# EAGLE design M0_Express_eh_shield_reve (EAGLE 9.5.2)

## Sheet 1 of 2
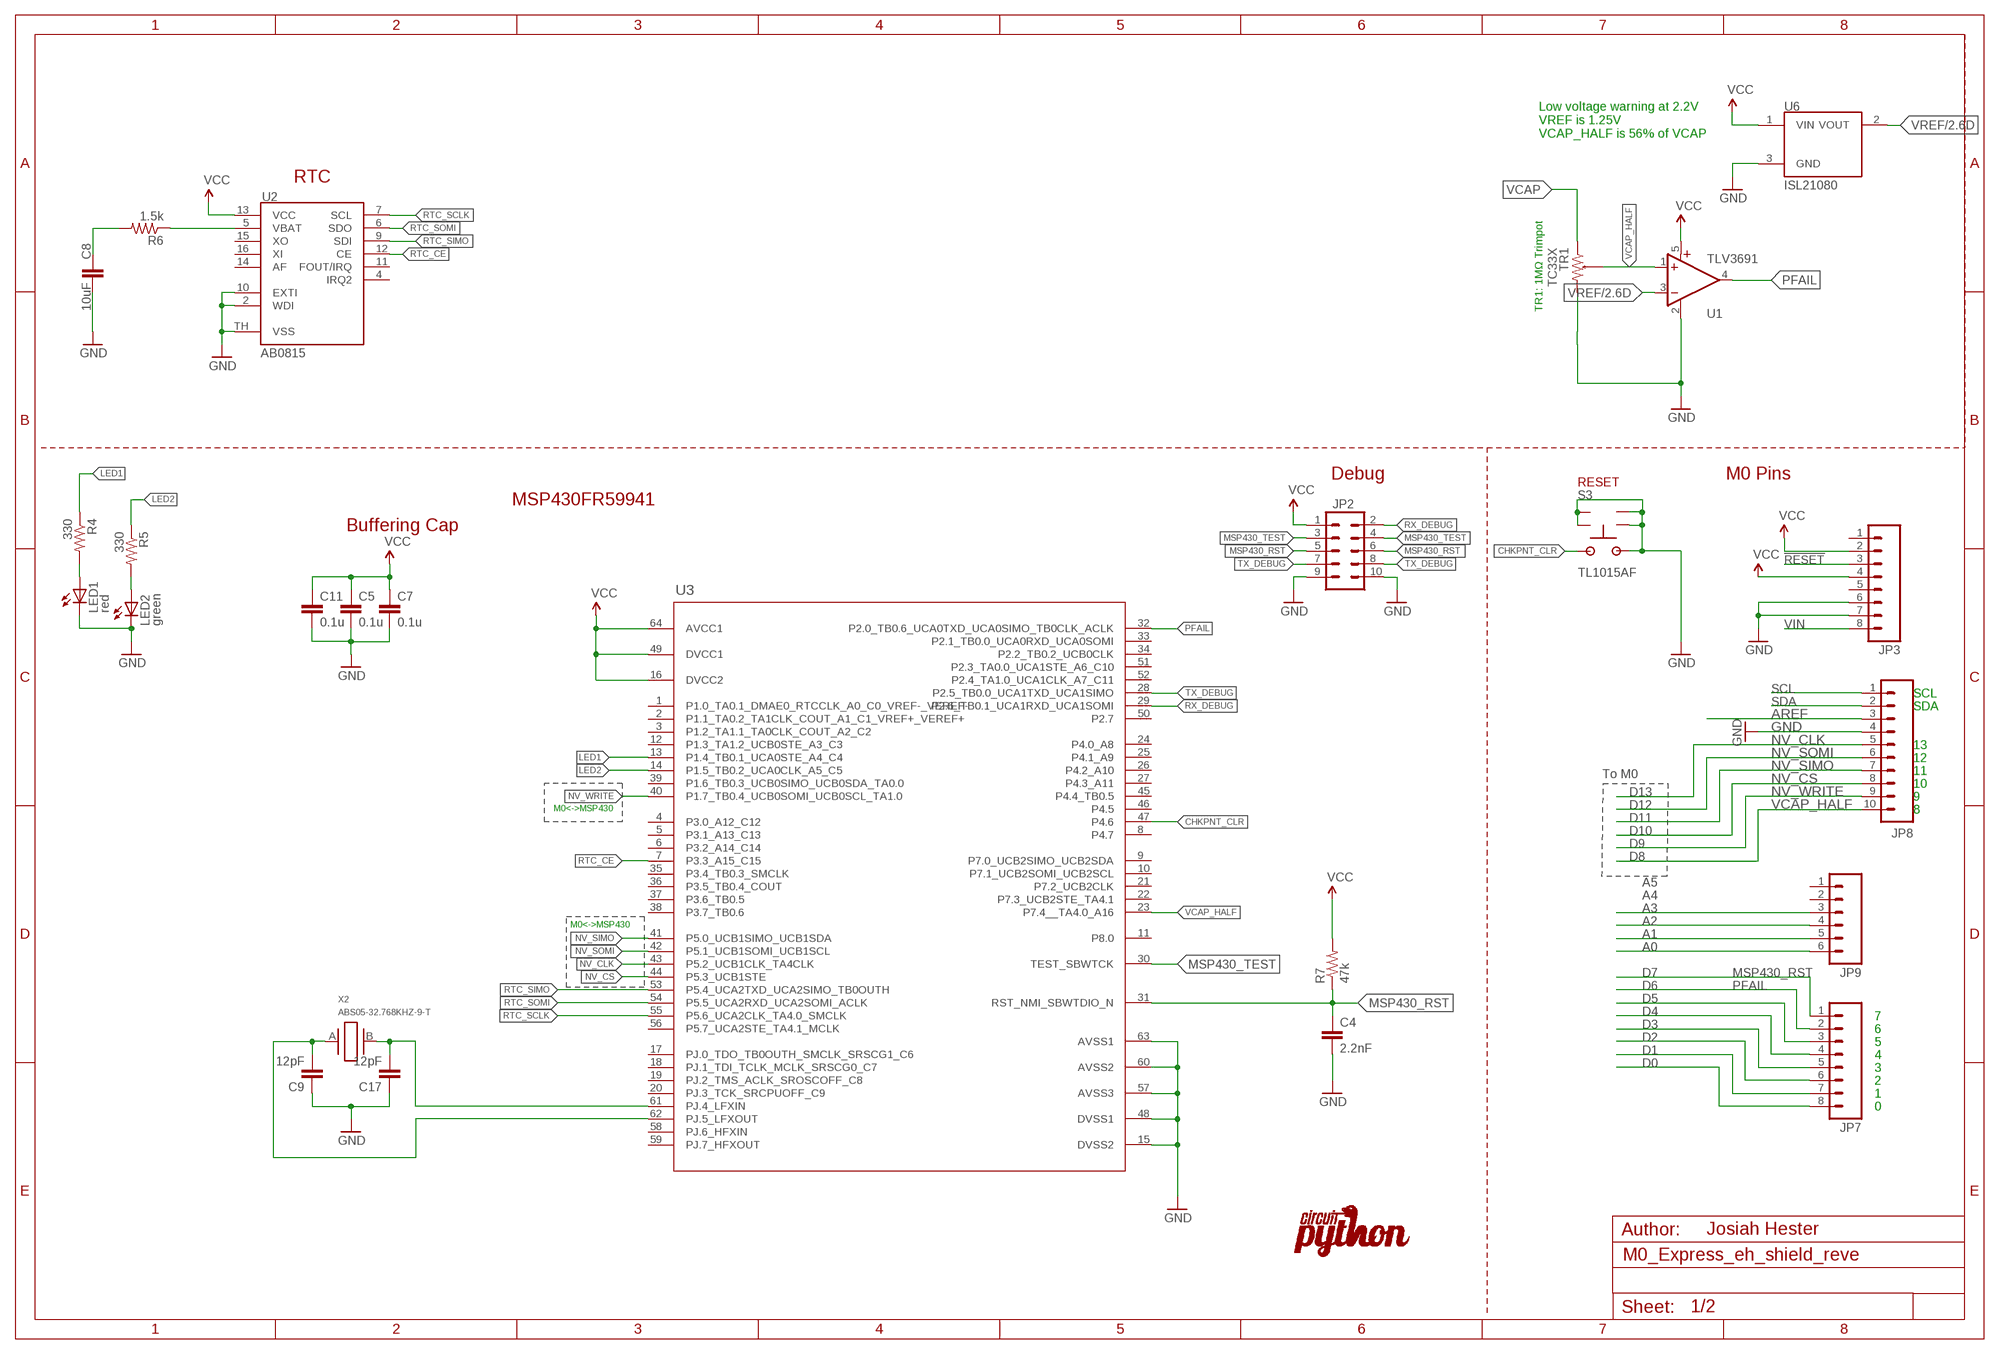
[diagram p0: schematic, sheet 1]

### Parts
C4  2.2nF  C-EU0603  [0603@1]
C5  0.1u  C-EU0603  [0603@1]
C7  0.1u  C-EU0603  [0603@1]
C8  10uF  CAP0805  [0805]
C9  12pF  C-EU0603  [0603@1]
C11  0.1u  C-EU0603  [0603@1]
C17  12pF  C-EU0603  [0603@1]
JP2  M05X21.27MM  [2X5_1.27MM]
JP3  M08LOCK  [1X08_LOCK]
JP7  M08LOCK  [1X08_LOCK]
JP8  M10LOCK  [1X10_LOCK]
JP9  M06LOCK  [1X06_LOCK]
LED1  red  LED0603  [LED-0603]
LED2  green  LED0603  [LED-0603]
R4  330  R-EU0603  [0603]
R5  330  R-EU0603  [0603]
R6  1.5k  R-EU0603  [0603]
R7  47k  R-EU0603  [0603]
S3  TL1015AF  [TS1015]
TR1  TC33X  [TC33X]
U1  TLV3691  [SC70-5]
U2  AB0815  [QFN16]
U3  MSP430FR5994IPM  [PM0064A_N]
U6  ISL21080  [SOT-23]
U$1  LOGO  [CIRCUITPYTHON-LOGO]
X2  ABS05-32.768KHZ-9-T  [ABS05]

### Nets
!RESET: JP3.3
A0: JP9.6
A1: JP9.5
A2: JP9.4
A3: JP9.3
AREF [aref]: JP8.3
CHKPNT_CLR: S3.2 U3.47(P4.6)
D0: JP7.8
D1: JP7.7
D2: JP7.6
D3: JP7.5
D4: JP7.4
D5: JP7.3
GND [gnd]: C4.2 C5.2 C7.2 C8.2 C9.1 C11.2 C17.1 JP2.9 JP2.10 JP3.6 JP3.7 JP8.4 LED1.C LED2.C S3.1 S3.G1(GND) S3.G2(GND) S3.G3(GND) S3.G4(GND) TR1.2 U1.2(GND) U2.2(WDI) U2.10(EXTI) U2.TH(VSS) U3.15(DVSS2) U3.48(DVSS1) U3.57(AVSS3) U3.60(AVSS2) U3.63(AVSS1) U6.3(GND) ; also sheet 2
LED1: R4.1 U3.13(P1.4_TB0.1_UCA0STE_A4_C4)
LED2: R5.1 U3.14(P1.5_TB0.2_UCA0CLK_A5_C5)
MSP430_RST: C4.1 JP2.5 JP2.6 JP7.1 R7.1 U3.31(RST_NMI_SBWTDIO_N)
MSP430_TEST: JP2.3 JP2.4 U3.30(TEST_SBWTCK)
N$3: JP3.2 ; supply symbol labelled VCC
N$4: R6.1 U2.5(VBAT)
N$5: C17.2 U3.61(PJ.4_LFXIN) X2.B
N$6: C9.2 U3.62(PJ.5_LFXOUT) X2.A
N$8: C8.1 R6.2
N$14: LED1.A R4.2
N$15: LED2.A R5.2
NV_CLK: JP8.5 U3.43(P5.2_UCB1CLK_TA4CLK)
NV_CS: JP8.8 U3.44(P5.3_UCB1STE)
NV_SIMO: JP8.7 U3.41(P5.0_UCB1SIMO_UCB1SDA)
NV_SOMI: JP8.6 U3.42(P5.1_UCB1SOMI_UCB1SCL)
NV_WRITE: JP8.9 U3.40(P1.7_TB0.4_UCB0SOMI_UCB0SCL_TA1.0)
PFAIL: JP7.2 U1.4(OUT) U3.32(P2.0_TB0.6_UCA0TXD_UCA0SIMO_TB0CLK_ACLK)
RTC_CE: U2.12(CE) U3.7(P3.3_A15_C15)
RTC_SCLK: U2.7(SCL) U3.55(P5.6_UCA2CLK_TA4.0_SMCLK)
RTC_SIMO: U2.9(SDI) U3.53(P5.4_UCA2TXD_UCA2SIMO_TB0OUTH)
RTC_SOMI: U2.6(SDO) U3.54(P5.5_UCA2RXD_UCA2SOMI_ACLK)
RX_DEBUG: JP2.2 U3.29(P2.6_TB0.1_UCA1RXD_UCA1SOMI)
SCL: JP8.1
SDA: JP8.2
TX_DEBUG: JP2.7 JP2.8 U3.28(P2.5_TB0.0_UCA1TXD_UCA1SIMO)
VCAP: TR1.1 ; also sheet 2
VCAP_HALF: JP8.10 TR1.W U1.1(+IN) U3.23(P7.4__TA4.0_A16)
VCC: C5.1 C7.1 C11.1 JP2.1 JP3.4 R7.2 U1.5(V+) U2.13(VCC) U3.16(DVCC2) U3.49(DVCC1) U3.64(AVCC1) U6.1(VIN) ; also sheet 2
VIN [USB]: JP3.8
VREF: U1.3(-IN) U6.2(VOUT) ; also sheet 2
Unconnected: JP3.1 JP3.5 JP9.1 JP9.2 U2.4(IRQ2) U2.11(FOUT/IRQ) U2.14(AF) U2.15(XO) U2.16(XI) U3.1(P1.0_TA0.1_DMAE0_RTCCLK_A0_C0_VREF-_VEREF-) U3.2(P1.1_TA0.2_TA1CLK_COUT_A1_C1_VREF+_VEREF+) U3.3(P1.2_TA1.1_TA0CLK_COUT_A2_C2) U3.4(P3.0_A12_C12) U3.5(P3.1_A13_C13) U3.6(P3.2_A14_C14) U3.8(P4.7) U3.9(P7.0_UCB2SIMO_UCB2SDA) U3.10(P7.1_UCB2SOMI_UCB2SCL) U3.11(P8.0) U3.12(P1.3_TA1.2_UCB0STE_A3_C3) U3.17(PJ.0_TDO_TB0OUTH_SMCLK_SRSCG1_C6) U3.18(PJ.1_TDI_TCLK_MCLK_SRSCG0_C7) U3.19(PJ.2_TMS_ACLK_SROSCOFF_C8) U3.20(PJ.3_TCK_SRCPUOFF_C9) U3.21(P7.2_UCB2CLK) U3.22(P7.3_UCB2STE_TA4.1) U3.24(P4.0_A8) U3.25(P4.1_A9) U3.26(P4.2_A10) U3.27(P4.3_A11) U3.33(P2.1_TB0.0_UCA0RXD_UCA0SOMI) U3.34(P2.2_TB0.2_UCB0CLK) U3.35(P3.4_TB0.3_SMCLK) U3.36(P3.5_TB0.4_COUT) U3.37(P3.6_TB0.5) U3.38(P3.7_TB0.6) U3.39(P1.6_TB0.3_UCB0SIMO_UCB0SDA_TA0.0) U3.45(P4.4_TB0.5) U3.46(P4.5) U3.50(P2.7) U3.51(P2.3_TA0.0_UCA1STE_A6_C10) U3.52(P2.4_TA1.0_UCA1CLK_A7_C11) U3.56(P5.7_UCA2STE_TA4.1_MCLK) U3.58(PJ.6_HFXIN) U3.59(PJ.7_HFXOUT)

### Notes on the sheet
- Low voltage warning at 2.2V
  VREF is 1.25V
  VCAP_HALF is 56% of VCAP
- RTC
- TR1: 1MΩ Trimpot
- Debug | M0 Pins
- RESET
- MSP430FR59941
- Buffering Cap
- SCL
- SDA
- 13
- 12
- 11
- To M0
- 10
- D13 | 9
- M0<->MSP430 | D12 | 8
- D11
- D10
- D9
- D8
- A5
- A4
- M0<->MSP430
- D7
- D6
- 7
- 6
- 5
- 4
- 3
- 2
- 1
- 0
- Josiah Hester

## Sheet 2 of 2
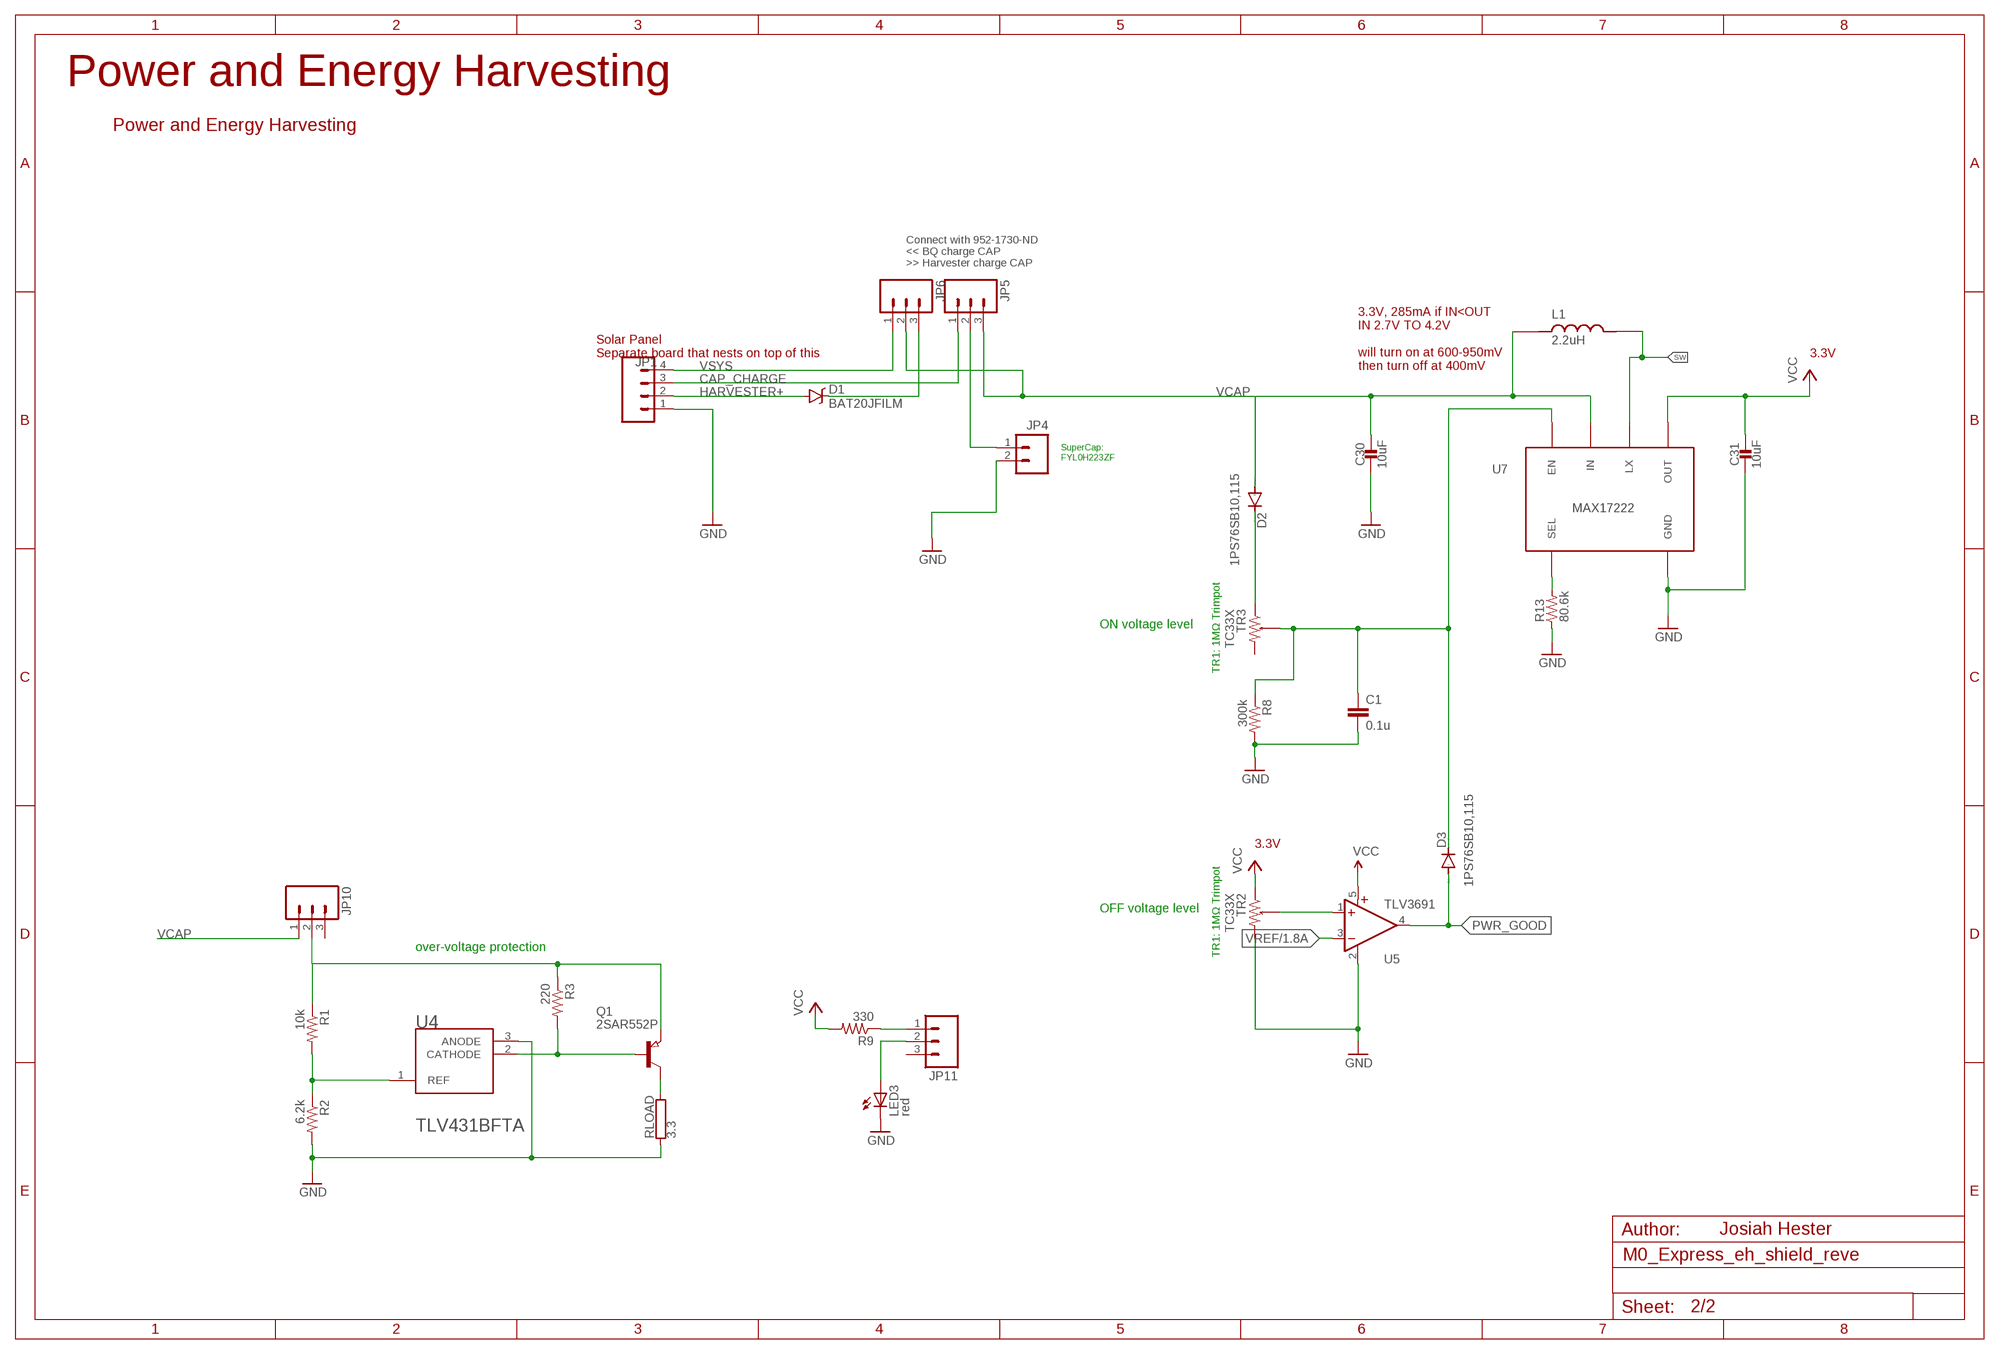
[diagram p1: schematic, sheet 2]

### Parts
C1  0.1u  C-EU0603  [0603@1]
C30  10uF  CAPACITOR0603_CAP  [0603_CAP]
C31  10uF  CAPACITOR0603_CAP  [0603_CAP]
D1  BAT20JFILM  [SOD-323]
D2  1PS76SB10,115  DIODE-SOD323-R  [SOD323-R]
D3  1PS76SB10,115  DIODE-SOD323-R  [SOD323-R]
JP1  M04LOCK  [1X04_LOCK]
JP4  M025MM  [SCREWTERMINAL-5MM-2]
JP5  M03  [1X03-1.27MM]
JP6  M03  [1X03-1.27MM]
JP10  M03  [1X03-1.27MM]
JP11  M03  [1X03-1.27MM]
L1  2.2uH  XFL4020-222MEB  [IND_XFL4020-222MEB]
LED3  red  LED0603  [LED-0603]
Q1  2SAR552P  PNP-TRANSISTOR_SOT89  [SOT89]
R1  10k  R-EU0603  [0603]
R2  6.2k  R-EU0603  [0603]
R3  220  R-EU0603  [0603]
R8  300k  R-EU0603  [0603]
R9  330  R-EU0603  [0603]
R13  80.6k  RESISTOR0603_RES  [0603-RES]
RLOAD  3.3  RCA4060  [CA4060]
TR2  TC33X  [TC33X]
TR3  TC33X  [TC33X]
U4  DIODES_TLV431BFTADIODES_TLV431BFTA_0_0  [DIODES_TLV431BFTA_0]
U5  TLV3691  [SC70-5]
U7  MAX17222  [UDFN-6-MAXIM]

### Nets
CAP_CHARGE: JP1.3 JP5.1
GND [gnd]: C1.2 C30.2 C31.2 JP1.1 JP4.2 LED3.C R2.2 R8.2 R13.1 RLOAD.1 TR2.2 U4.3(ANODE) U5.2(GND) U7.3(GND) ; also sheet 1
HARVESTER+: D1.A JP1.2
N$1: D1.C JP6.3
N$2: JP4.1 JP5.2
N$7: R1.2 R2.1 U4.1(REF)
N$9: JP11.1 R9.1
N$10: JP10.2 Q1.3(E) R1.1 R3.1
N$11: Q1.1(B) R3.2 U4.2(CATHODE)
N$12: R13.2 U7.4(SEL)
N$13: Q1.2(C) RLOAD.2
N$16: C1.1 D3.C R8.1 TR3.W U7.6(EN)
N$17: D2.C TR3.1
N$18: JP11.2 LED3.A
ON_LVL: TR2.W U5.1(+IN)
PWR_GOOD: D3.A U5.4(OUT)
SW: L1.2 U7.2(LX)
VCAP: C30.1 D2.A JP5.3 JP6.2 JP10.1 L1.1 U7.5(IN) ; also sheet 1
VCC: C31.1 R9.2 TR2.1 U5.5(V+) U7.1(OUT) ; also sheet 1
VREF: U5.3(-IN) ; also sheet 1
VSYS: JP1.4 JP6.1
Unconnected: JP10.3 JP11.3 TR3.2

### Notes on the sheet
- Power and Energy Harvesting
- Power and Energy Harvesting
- Connect with 952-1730-ND
  << BQ charge CAP
  >> Harvester charge CAP
- Solar Panel
  Separate board that nests on top of this
- 3.3V
- 3.3V, 285mA if IN<OUT
  IN 2.7V TO 4.2V
  
  will turn on at 600-950mV
  then turn off at 400mV
- SuperCap:
  FYL0H223ZF
- TR1: 1MΩ Trimpot
- ON voltage level
- 3.3V
- TR1: 1MΩ Trimpot
- OFF voltage level
- over-voltage protection
- Divider for Lithium Titanate
- Josiah Hester

## Library data of the parts
C1 C5 C7 C11 = tiny_passives:C-EU; DIGIKEY: 1276-1005-1-ND; MPN: CL10B104KO8NNNC
C4 = tiny_passives:C-EU; DIGIKEY: 478-1219-1-ND; MPN: 06035C222KAT2A
C8 = SparkFun-Capacitors:CAP: Capacitor Standard 0603 ceramic capacitor, and 0.1" leaded capacitor.; DIGIKEY: 1276-6456-1-ND
C9 C17 = tiny_passives:C-EU; DIGIKEY: 1276-1254-1-ND; MPN: CL10C120JB8NNNC
C30 C31 = passives:CAPACITOR: SMD Capacitor; DIGIKEY: 490-3896-1-ND; MPN: GRM188R60J106ME47D
D1 = SparkFun-DiscreteSemi:BAT20JFILM: 23V, 1A Schottky diode, SOD-323 package; DIGIKEY: NSR0530HT1GOSCT-ND; PROD_ID: DIO-11623
D2 D3 = diode:DIODE-: DIODE
JP1 = SparkFun-Connectors:M04: Header 4 Standard 4-pin 0.1" header. Use with straight break away headers (SKU : PRT-00116), right angle break away headers (PRT-00553), swiss pins (PRT-00743), machine pins (PRT-00117), and female headers (PRT-00115). Molex polarized connector foot print use with SKU : PRT-08231 with associated crimp pins and housings. 1MM SMD Version SKU: PRT-10208
JP2 = SparkFun-Connectors:M05X2: Header 5x2 Standard 10-pin dual row 0.1" header. Commonly used with AVR-ISP. Use with Spark Fun Electronics SKU: PRT-00778; DIGIKEY: 1175-1627-ND; MPN: 3220-10-0100-00
JP3 JP7 = SparkFun-Connectors:M08: Header 8 Standard 8-pin 0.1" header. Use with straight break away headers (SKU : PRT-00116), right angle break away headers (PRT-00553), swiss pins (PRT-00743), machine pins (PRT-00117), and female headers (PRT-00115).
JP4 = SparkFun-Connectors:M02: Standard 2-pin 0.1" header. Use with - straight break away headers ( PRT-00116) - right angle break away headers (PRT-00553) - swiss pins (PRT-00743) - machine pins (PRT-00117) - female headers (PRT-00115) Molex polarized connector foot print use with: PRT-08233 with associated crimp pins and housings. 2.54_SCREWTERM for use with PRT-10571. 3.5mm Screw Terminal footprints for PRT-08084 5mm Screw Terminal footprints for use with PRT-08432; STOREFRONT_ID: PRT-08432
JP5 JP6 JP10 JP11 = SparkFun-Connectors:M03: Header 3 Standard 3-pin 0.1" header. Use with straight break away headers (SKU : PRT-00116), right angle break away headers (PRT-00553), swiss pins (PRT-00743), machine pins (PRT-00117), and female headers (PRT-00115). Molex polarized connector foot print use with SKU : PRT-08232 with associated crimp pins and housings.
JP8 = SparkFun-Connectors:M10: Header 10 Standard 10-pin 0.1" header. Use with straight break away headers (SKU : PRT-00116), right angle break away headers (PRT-00553), swiss pins (PRT-00743), machine pins (PRT-00117), and female headers (PRT-00115).
JP9 = SparkFun-Connectors:M06: Header 6 Standard 6-pin 0.1" header. Use with straight break away headers (SKU : PRT-00116), right angle break away headers (PRT-00553), swiss pins (PRT-00743), machine pins (PRT-00117), and female headers (PRT-00115). Molex polarized connector foot print use with SKU : PRT-08094 with associated crimp pins and housings. NOTES ON THE VARIANTS LOCK and LOCK_LONGPADS... This footprint was designed to help hold the alignment of a through-hole component (i.e. 6-pin header) while soldering it into place. You may notice that each hole has been shifted either up or down by 0.005 of an inch from it's more standard position (which is a perfectly straight line). This slight alteration caused the pins (the squares in the middle) to touch the edges of the holes. Because they are alternating, it causes a "brace" to hold the component in place. 0.005 has proven to be the perfect amount of "off-center" position when using our standard breakaway headers. Although looks a little odd when you look at the bare footprint, once you have a header in there, the alteration is very hard to notice. Also,if you push a header all the way into place, it is covered up entirely on the bottom side. This idea of altering the position of holes to aid alignment will be further integrated into the Sparkfun Library for other footprints. It can help hold any component with 3 or more connection pins.
L1 = XFL4020-222MEB:XFL4020-222MEB: Power inductor, shielded, 20% tol, SMT, RoHS, halogen free Check availability <https://pricing.snapeda.com/parts/XFL4020-222MEB/Coilcraft/view-part?ref=eda>; AVAILABILITY: In Stock; DESCRIPTION: Power inductor, shielded, 20% tol, SMT, RoHS, halogen free; MF: Coilcraft; MP: XFL4020-222MEB; PACKAGE: None; PRICE: None
LED1-LED3 = SparkFun-LED:LED: LEDs Standard schematic elements and footprints for 5mm, 3mm, 1206, and 0603 sized LEDs. 5mm - Spark Fun Electronics SKU : COM-00529 (and others)
Q1 = semicon-smd-ipc:PNP-TRANSISTOR_: PNP TRANSISTOR
R1-R5 R8 R9 = tiny_passives:R-EU
R6 = tiny_passives:R-EU; DIGIKEY: A121524CT-ND; MPN: CRG0603F1K5
R7 = tiny_passives:R-EU; DIGIKEY: 541-4061-1-ND; MPN: CRCW060347K0JNEAC
R13 = passives:RESISTOR: Resistor Basic schematic elements and footprints for 0201, 0402, 0603, 1206, and PTH resistors.; DIGIKEY: 311-80.6KHRCT-ND; MPN: RC0603FR-0780K6L
RLOAD = resistor-power:R: Power Resitor; OC_FARNELL: unknown; OC_NEWARK: unknown
S3 = eswitch:TL1015AF; MPN: TL1015AF160QG
TR1-TR3 = bourns_tc33_trimpots:TC33X; DIGIKEY: TC33X-2-105ECT-ND; MPN: TC33X-2-105E
U1 U5 = tlv3691:TLV3691: 0.9-V to 6.5-V, Nanopower Comparator Datasheets Analog Signal Chain Guide <http://www.ti.com/lit/pdf/slyb174> TLV3691 <http://www.ti.com/lit/ds/symlink/tlv3691.pdf> Manufacturer Product Page TLV3691IDPFR Specifications <http://www.ti.com/general/docs/suppproductinfo.tsp?distId=10&orderablePartNumber=TLV3691IDPFR> Standard Package <javascript:dlgHelp('Standard%20Packaging%20Help');> 1 Category Integrated Circuits (ICs) </product-search/en/integrated-circuits-ics> Family Linear - Comparators </product-search/en/integrated-circuits-ics/linear-comparators/2556221> Series - Packaging <javascript:dlgHelp('Standard%20Packaging%20Help');> Cut Tape (CT) <javascript:dlgHelp('Cut%20Tape%20Help');> Type General Purpose Number of Elements 1 Output Type Push-Pull Voltage - Supply, Single/Dual (±) 0.9 V ~ 6.5 V, ±0.45 V ~ 3.25 V Voltage - Input Offset (Max) 3mV Current - Input Bias (Max) 100pA Current - Output (Typ) 42mA Current - Quiescent (Max) 150nA CMRR, PSRR (Typ) - Propagation Delay (Max) 35µs Hysteresis - Operating Temperature -40°C ~ 125°C Package / Case 6-XFDFN Mounting Type Surface Mount Supplier Device Package 6-X2SON (1x1) Online Catalog Comparators - 1 element </catalog/en/partgroup/comparators-1-element/3112?mpart=TLV3691IDPFR&vendor=296&WT.z_ref_page_type=PS&WT.z_ref_page_sub_type=PD&WT.z_ref_page_id=PD&WT.z_ref_page_event=DC_Link_Table> Other Names 296-37242-1; DIGIKEY: 296-37910-1-ND; MPN: TLV3691IDCKR
U2 = AB08XX:AB0815: AB08X5 Real-Time Clock Family: SPI The ABRACON AB08X5 Real-Time Clock family provides a groundbreaking combination of ultra-low power coupled with a highly sophisticated feature set. With power requirements significantly lower than any other industry RTC (as low as 14 nA), these are the first semiconductors based on innovative SPOTTM (Subthreshold Power Optimized Technology) CMOS platform. The AB08X5 includes on-chip oscillators to provide minimum power consumption, full RTC functions including battery backup and programmable counters and alarms for timer and watchdog functions, and either an I2C or SPI serial interface for communication with a host controller.; DIGIKEY: 535-11930-1-ND; MPN: AB0815-T3
U3 = msp430FR5994IMP:MSP430FR5994IPM; COPYRIGHT: Copyright (C) 2022 Ultra Librarian. All rights reserved.; DIGIKEY: 296-45561-1-ND; MANUFACTURER_PART_NUMBER: MSP430FR5994IPM; MFR_NAME: Texas Instruments; REFDES: RefDes; TYPE: TYPE
U4 = Diodes - TLV431BFTA:DIODES_TLV431BFTA: 1.24V COST EFFECTIVE SHUNT REGULATOR; CENTROID_NOT_SPECIFIED: No; DATASHEET: https://www.diodes.com/assets/Datasheets/TLV431.pdf; DIGIKEY_DESCRIPTION: IC VREF SHUNT ADJ SOT23-3; DIGIKEY_PART_NUMBER: TLV431BFCT-ND; LEAD_FREE: yes; MF: Diodes; MOUSER_PART_NUMBER: 621-TLV431BFTA; MPN: TLV431BFTA; PACKAGE: SOT23-3; PREFIX: U; ROHS: yes; TEMPERATURE_RANGE_HIGH: +125°C; TEMPERATURE_RANGE_LOW: -40°C
U6 = isl21080:ISL21080: Intersil: ISL21080, 300nA NanoPower Voltage References The ISL21080 analog voltage references feature low supply voltage operation at ultra-low 310nA typ, 1.5µA max operating current. Additionally, the ISL21080 family features guaranteed initial accuracy as low as ±0.2% and 50ppm/°C temperature coefficient. These references are ideal for general purpose portable applications to extend battery life at lower cost. The ISL21080 is provided in the industry standard 3 Ld SOT-23 pinout. The ISL21080 output voltages can be used as precision voltage sources for voltage monitors, control loops, standby voltages for low power states for DSP, FPGA, Datapath Controllers, microcontrollers and other core voltages: 0.9V, 1.024V, 1.25V, 1.5V, 2.048V, 2.5V, 3.0V, 3.3V, 4.096V and 5.0V. Special Note: Post-assembly x-ray inspection may lead to permanent changes in device output voltage and should be minimized or avoided. For further information, please see “Applications Information” on page 14 and AN1533, “X-Ray Effects on Intersil FGA References”.; DIGIKEY: ISL21080DIH312Z-TKTR-ND; MPN: ISL21080DIH312Z-TK
U7 = chips:MAX17222: Very high efficiency, very low power boost converter suitable for EH applications; DIGIKEY: MAX17222ELT+TCT-ND; MANUFACTURER: MAXIM INTEGRATED; MPN: MAX17222ELT+T
U$1 = circuitpython-logo:LOGO
X2 = abs05:ABS05-32.768KHZ: 32.768kHz Crystal; DIGIKEY: 535-11897-1-ND; MPN: ABS05-32.768KHZ-9-T

## Board
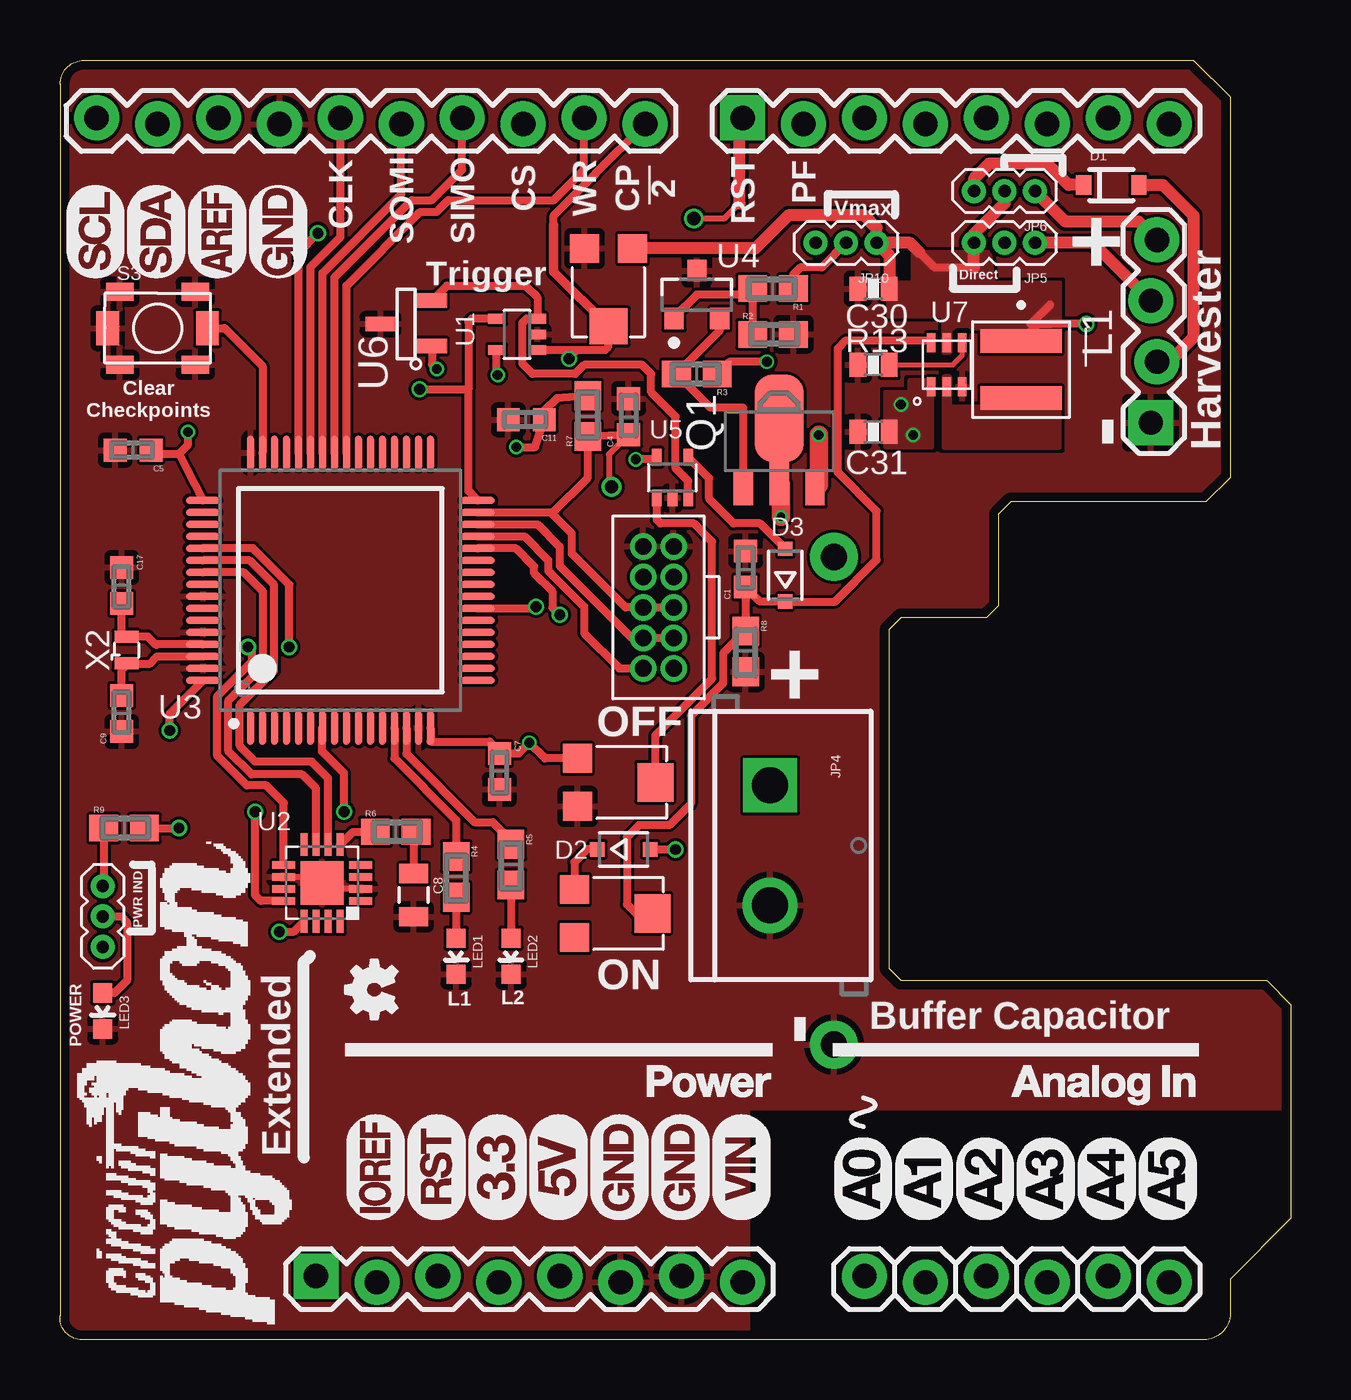
[diagram p2: board, top side]
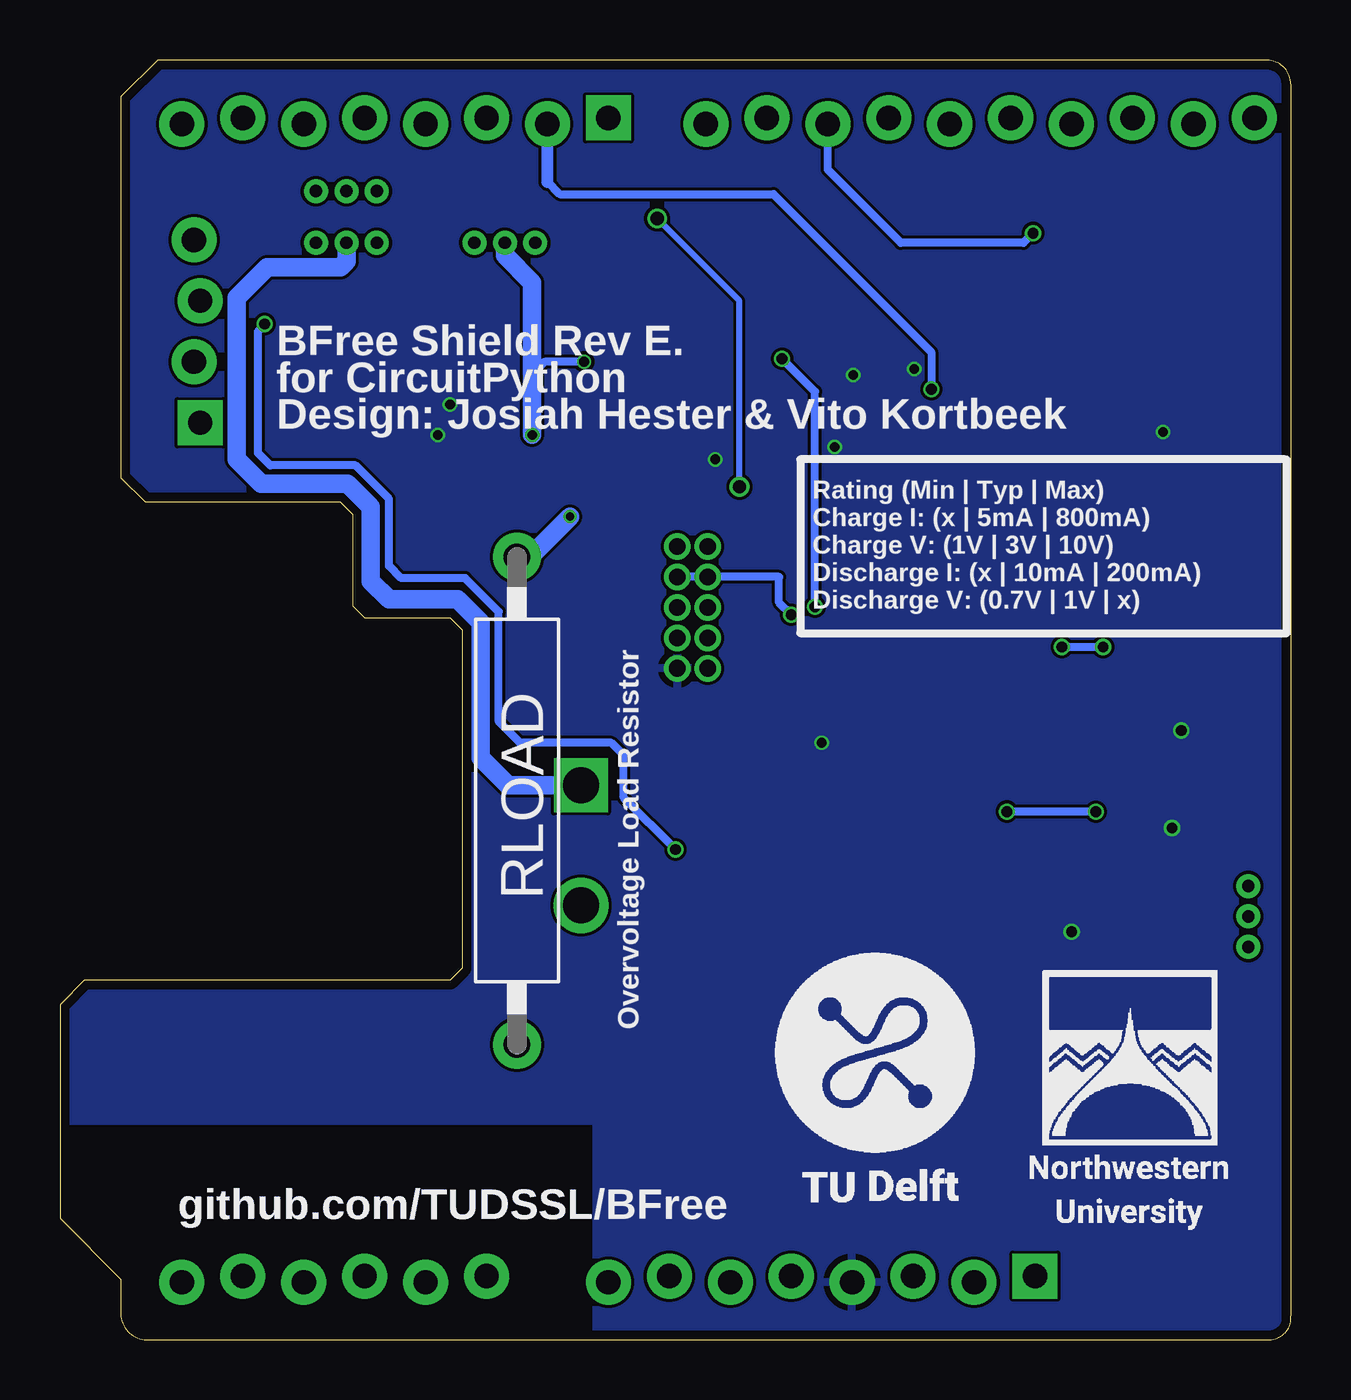
[diagram p3: board, bottom side, seen from below]

Size 51.31 x 53.32 mm. Coordinates in mm from the lower left corner, seen from the top.
Outline: 47.25,53.32 48.77,51.8 48.77,35.92 47.76,34.9 39.63,34.9 39.12,34.4 39.12,30.59 38.61,30.08 35.06,30.08 34.55,29.57 34.55,15.47 35.06,14.97 50.3,14.97 51.31,13.95 51.31,5.06 48.77,2.52 48.77,0.98 arc-90 47.59,0 0.83,0 arc-90 0,1 0,52.3 arc-90 1,53.3 47.25,53.32
Copper layers (1*16): Top 0.035559375mm / dielectric 0.17018125mm / Bottom 0.035559375mm
Design rules "oshpark-4layer *": minimum track width 5mil, minimum drill 10mil, track to track 5mil, track to pad 5mil, pad to pad 5mil, via to via 5mil, smd to smd 5mil, copper to edge 15mil, drill to drill 6mil, minimum pad ring 4mil, minimum via ring 4mil, stop-mask expansion 2.5mil, vias tented up to drill 0mil, thermal gap 10mil
tKeepout: area 76.4,1 to 76.5,1.5
tRestrict: area 74.9,2 to 75.4,2; area 74.9,1.5 to 75.4,1.5; area 75.4,1 to 75.5,1.5; area 83.1,1.2 to 83.2,1.8

### Footprints (pad centres in the part's own frame; a part is rotated, then mirrored left to right if it is on the bottom)
0603@1 = smd 0.95 x 0.95: 1 -0.75,0; 2 0.75,0
0805 = smd 0.8 x 1.2: 1 -0.9,0; 2 0.9,0
0603_CAP = smd 0.7 x 1: 1 -0.65,0; 2 0.65,0
SOD-323 = smd 0.63 x 0.83: A 1.15,0; C -1.15,0
SOD323-R = smd 0.6 x 0.6: A 1.1,0; C -1.1,0
1X04_LOCK = drill 1.016 pad 1.88 square: 1 0,0.127 | drill 1.016 pad 1.88: 2 2.54,-0.127; 3 5.08,0.127; 4 7.62,-0.127
2X5_1.27MM = drill 0.7 pad 1.1: 1 0,0; 2 1.27,0; 3 0,-1.27; 4 1.27,-1.27; 5 0,-2.54; 6 1.27,-2.54; 7 0,-3.81; 8 1.27,-3.81; 9 0,-5.08; 10 1.27,-5.08
1X08_LOCK = drill 1.016 pad 1.88 square: 1 0,0.127 | drill 1.016 pad 1.88: 2 2.54,-0.127; 3 5.08,0.127; 4 7.62,-0.127; 5 10.16,0.127; 6 12.7,-0.127; 7 15.24,0.127; 8 17.78,-0.127
SCREWTERMINAL-5MM-2 = drill 1.5 pad 2.232 square: 1 0,0 | drill 1.5 pad 2.3: 2 5,0
1X03-1.27MM = drill 0.508 pad 1: 1 -1.27,0; 2 0,0; 3 1.27,0
1X10_LOCK = drill 1.016 pad 1.88: 1 0,0.127; 2 2.54,-0.127; 3 5.08,0.127; 4 7.62,-0.127; 5 10.16,0.127; 6 12.7,-0.127; 7 15.24,0.127; 8 17.78,-0.127; 9 20.32,0.127; 10 22.86,-0.127
1X06_LOCK = drill 1.016 pad 1.88: 1 0,0; 2 2.54,-0.254; 3 5.08,0; 4 7.62,-0.254; 5 10.16,0; 6 12.7,-0.254
IND_XFL4020-222MEB = smd 0.98 x 3.4: 1 -1.185,0; 2 1.185,0
LED-0603 = smd 0.8 x 0.8: A 0,-0.75; C 0,0.75
SOT89 = smd 0.8 x 1.4: 1 -1.499,-1.981; 3 1.499,-1.981 | smd 0.8 x 1.9: 2 0,-1.727 | smd 2.032 x 3.65: 2@1 0,0.94
0603 = smd 1.2 x 1.1: 1 -0.85,0; 2 0.85,0
0603-RES = smd 0.7 x 1: 1 -0.65,0; 2 0.65,0
CA4060 = drill 1.1 pad 2: 1 -10.16,0; 2 10.16,0
TS1015 = smd 0.95 x 1.4: 1 -2.075,0; 2 2.075,0 | smd 1.15 x 0.75: G1 -1.575,1.525; G2 1.575,1.525; G3 -1.575,-1.525; G4 1.575,-1.525
TC33X = smd 1.2 x 1.2: 1 -1,-1.8; 2 1,-1.8 | smd 1.6 x 1.5: W 0,1.45
SC70-5 = smd 0.4 x 0.7: 1 -0.65,-0.85; 2 0,-0.85; 3 0.65,-0.85; 4 0.65,0.85; 5 -0.65,0.85
QFN16 = smd 0.95 x 0.3: 1 -1.6,0.75; 2 -1.6,0.25; 3 -1.6,-0.25; 4 -1.6,-0.75; 9 1.6,-0.75; 10 1.6,-0.25; 11 1.6,0.25; 12 1.6,0.75 | smd 0.3 x 0.95: 5 -0.75,-1.6; 6 -0.25,-1.6; 7 0.25,-1.6; 8 0.75,-1.6; 13 0.75,1.6; 14 0.25,1.6; 15 -0.25,1.6; 16 -0.75,1.6 | smd 1.8 x 1.8: TH 0,0
PM0064A_N = smd 1.45 x 0.3: 1 -5.725,3.75; 2 -5.725,3.25; 3 -5.725,2.75; 4 -5.725,2.25; 5 -5.725,1.75; 6 -5.725,1.25; 7 -5.725,0.75; 8 -5.725,0.25; 9 -5.725,-0.25; 10 -5.725,-0.75; 11 -5.725,-1.25; 12 -5.725,-1.75; 13 -5.725,-2.25; 14 -5.725,-2.75; 15 -5.725,-3.25; 16 -5.725,-3.75; 33 5.725,-3.75; 34 5.725,-3.25; 35 5.725,-2.75; 36 5.725,-2.25; 37 5.725,-1.75; 38 5.725,-1.25; 39 5.725,-0.75; 40 5.725,-0.25; 41 5.725,0.25; 42 5.725,0.75; 43 5.725,1.25; 44 5.725,1.75; 45 5.725,2.25; 46 5.725,2.75; 47 5.725,3.25; 48 5.725,3.75 | smd 0.3 x 1.45: 17 -3.75,-5.725; 18 -3.25,-5.725; 19 -2.75,-5.725; 20 -2.25,-5.725; 21 -1.75,-5.725; 22 -1.25,-5.725; 23 -0.75,-5.725; 24 -0.25,-5.725; 25 0.25,-5.725; 26 0.75,-5.725; 27 1.25,-5.725; 28 1.75,-5.725; 29 2.25,-5.725; 30 2.75,-5.725; 31 3.25,-5.725; 32 3.75,-5.725; 49 3.75,5.725; 50 3.25,5.725; 51 2.75,5.725; 52 2.25,5.725; 53 1.75,5.725; 54 1.25,5.725; 55 0.75,5.725; 56 0.25,5.725; 57 -0.25,5.725; 58 -0.75,5.725; 59 -1.25,5.725; 60 -1.75,5.725; 61 -2.25,5.725; 62 -2.75,5.725; 63 -3.25,5.725; 64 -3.75,5.725
DIODES_TLV431BFTA_0 = smd 0.9 x 0.8: 1 -1,0.95; 2 -1,-0.95; 3 1,0
SOT-23 = smd 0.6 x 1.25: 1 -0.95,-1.075; 2 0.95,-1.075; 3 -0.025,1.075
UDFN-6-MAXIM = smd 0.8 x 0.35: 1 -0.915,0.65; 2 -0.915,0; 3 -0.915,-0.65; 4 0.915,-0.65; 5 0.915,0; 6 0.915,0.65
ABS05 = smd 0.5 x 1: A -0.55,0; B 0.55,0

### Placement (x,y rotation side)
C1  28.58,32.11 90 top
C4  23.7,38.46 90 top
C5  3.05,37.06 180 top
C7  18.32,23.68 270 top
C8  14.74,18.52 270 top
C9  2.57,26.09 90 top
C11  19.43,38.33 180 top
C17  2.57,31.42 270 top
C30  33.91,43.79 180 top
C31  33.91,37.83 180 top
D1  43.82,48.11 0 top
D2  23.5,20.43 0 top
D3  30.23,31.86 90 top
JP1  45.6,38.21 90 top
JP2  25.58,27.97 180 top
JP3  10.67,2.52 0 top
JP4  29.59,23.09 270 top
JP5  39.37,45.7 180 top
JP6  39.37,47.86 180 top
JP7  28.45,50.78 0 top
JP8  1.53,50.78 0 top
JP9  46.23,2.39 180 top
JP10  32.77,45.7 180 top
JP11  1.78,17.63 270 top
L1  40.06,40.42 270 top
LED1  16.51,15.98 180 top
LED2  18.8,15.98 180 top
LED3  1.78,13.7 180 top
Q1  29.98,37.44 0 top
R1  29.72,43.79 180 top
R2  29.72,41.89 0 top
R3  26.55,40.24 180 top
R4  16.51,19.28 270 top
R5  18.8,19.79 270 top
R6  14,21.16 0 top
R7  22,38.49 90 top
R8  28.58,28.68 270 top
R9  2.67,21.32 0 top
R13  33.91,40.62 0 top
RLOAD  32.26,22.46 90 bottom
S3  4.07,42.14 0 top
TR1  22.86,43.67 180 top
TR2  23.37,23.22 270 top
TR3  23.24,17.76 270 top
U1  19.05,41.89 90 top
U2  10.93,19.03 180 top
U3  11.69,31.22 90 top
U4  26.55,43.54 90 top
U5  25.53,35.92 0 top
U6  14.43,42.35 90 top
U7  36.96,40.62 90 top
U$1  10.42,0.49 90 top
U$2  [OSHW-LOGO-MINI]  13.08,14.58 90 top
X2  2.77,28.73 90 top

### Tracks (layer width: path | path; a pad name or v marks a point on that pad's centre or on a via)
CAP_CHARGE
  Top 0.508: JP1.3 43.06,45.7 JP5.1
CHKPNT_CLR
  Top 0.33: S3.2 6.86,42.14 8.44,40.57 U3.47
GND
  Top 0.254: U2.10 10.68,19.28 U2.TH 11.18,18.78 U2.2
  pour Top (rank 5): -0.25,53.57 53.09,53.57 53.09,10.9 51.82,9.63 28.71,9.63 28.71,-0.78 -1.27,-0.78 -1.27,53.57
HARVESTER+
  Top 0.508: D1.A 45.98,48.11 47.25,46.84 47.25,41.76 46.23,40.75 JP1.2
LED1
  Top 0.33: U3.13 13.94,24.22 16.51,21.65 R4.1
LED2
  Top 0.33: U3.14 14.44,24.41 17.28,21.57 18.04,21.57 18.8,20.81 R5.1
MSP430_RST  (via drill 0.55)
  Top 0.254: C4.1 22.88,36.88 22.88,35.42 v22.99,35.54 | v26.42,46.72 27.69,46.72 28.32,47.35
  Top 0.33: C4.1 23.68,37.74 R7.1 22,35.92 20.55,34.47 20.45,34.47 | JP2.5 JP2.6 23.57,30.51 21.34,32.75 21.34,33.58 20.45,34.47 | U3.31 20.45,34.47
  Top 0.508: 28.32,47.35 28.32,50.78 JP7.1
  Bottom 0.254: v22.99,35.54 22.99,43.29 v26.42,46.72
MSP430_TEST
  Top 0.33: JP2.3 JP2.4 23.83,29.24 20.83,32.24 20.83,33.04 19.9,33.97 U3.30
N$1
  Top 0.508: D1.C 42.04,48.11 41.15,49 38.74,49 38.1,48.37 JP6.3
N$2
  Bottom 0.762: JP5.2 39.37,44.94 39.62,44.69 42.67,44.69 43.95,43.41 43.95,36.68 42.93,35.67 39.31,35.67 38.36,34.71 38.36,31.6 37.6,30.84 34.74,30.84 33.79,29.89 33.79,24.24 32.64,23.09 JP4.1
N$4
  Top 0.33: U2.5 12.21,21.16 R6.1
N$5
  Top 0.33: C17.2 2.57,29.49 X2.B 2.78,29.29 3.66,29.29 4.02,28.94 4.05,28.97 U3.61
N$6
  Top 0.33: 2.81,28.15 3.71,28.15 4.04,28.47 U3.62 | 2.81,28.15 X2.A | C9.2 2.57,27.91 2.81,28.15
N$7
  Top 0.33: R2.1 R1.2 28.62,43.54 26.55,43.54 25.6,42.59 U4.1
N$8
  Top 0.33: R6.2 14.74,21.15 C8.1
N$9
  Top 0.33: R9.1 1.82,18.94 JP11.1
N$10  (via drill 0.4)
  Top 0.33: R3.1 27.9,40.75 v29.47,40.75 | JP10.2 31.75,44.68 30.86,44.68 30.57,44.39 R1.1
  Top 0.762: v31.63,37.7 31.63,35.62 Q1.3
  Bottom 0.33: v29.47,40.75 31.12,40.75 31.63,40.24
  Bottom 0.762: JP10.2 32.77,45.19 31.63,44.05 31.63,40.24 v31.63,37.7
N$11
  Top 0.33: U4.2 27.5,42.04 R3.2 27.09,38.84 28.45,38.84 28.48,38.82 Q1.1
N$12
  Top 0.203: R13.2 37.21,40.62 37.61,41.02 U7.4
N$13  (via drill 0.35)
  Top 0.762: Q1.2 30.05,35.64 v30.05,34.29
  Bottom 0.762: RLOAD.2 31.73,32.62 v30.05,34.29
N$14
  Top 0.33: R4.2 LED1.A
N$15
  Top 0.33: R5.2 LED2.A
N$16
  Top 0.33: TR3.W 24.01,17.76 23.63,18.14 23.63,20.93 24.13,21.44 25.4,21.44 26.29,22.33 26.29,26 27.64,27.35 27.64,28.59 R8.1 C1.1 29.18,30.76 D3.C 32.3,30.76 34.04,32.49 34.04,34.52 32.43,36.14 32.43,41.29 32.77,41.64 36.21,41.64 U7.6
N$17
  Top 0.33: D2.C 21.97,20.43 21.44,19.9 TR3.1
N$18
  Top 0.33: JP11.2 2.54,17.63 2.8,17.38 2.8,14.97 2.28,14.45 LED3.A
NV_CLK
  Top 0.33: JP8.5 11.69,45.95 10.44,44.7 U3.43
NV_CS  (via drill 0.45)
  Top 0.33: U3.44 9.94,45.3 v10.75,46.11
  Bottom 0.33: v10.75,46.11 11.15,45.7 16.26,45.7 19.31,48.75 JP8.8
NV_SIMO
  Top 0.33: JP8.7 16.77,48.75 15.5,47.48 14.66,47.48 11.44,44.26 U3.41
NV_SOMI
  Top 0.33: JP8.6 14.23,47.73 10.94,44.44 U3.42
NV_WRITE
  Top 0.33: JP8.9 21.85,48.75 20.58,47.48 16.18,47.48 15.7,46.99 15.01,46.99 11.94,43.92 U3.40
ON_LVL
  Top 0.33: TR2.W 24.82,25.18 27.18,27.54 27.18,33.25 26.42,34.02 25.02,34.02 24.88,34.16 U5.1
PFAIL  (via drill 0.45)
  Top 0.33: U1.4 17.16,42.54 17.02,42.4 17.02,39.6 | v14.99,39.6 17.02,39.6 | U3.32 17.02,35.36 17.02,39.6
  Bottom 0.33: 30.99,48.24 30.48,47.73 21.57,47.73 14.99,41.15 v14.99,39.6
  Bottom 0.508: 30.99,48.24 JP7.2
PWR_GOOD
  Top 0.33: D3.A 29.17,34.02 28.07,34.02 27.05,35.03 27.05,35.9 U5.4
RTC_CE  (via drill 0.45)
  Top 0.33: U2.12 8.37,18.28 8.13,18.52 v8.13,22 | v11.84,22 11.84,23.6 10.93,24.52 10.93,25.48 U3.7
  Bottom 0.33: v8.13,22 11.74,22 v11.84,22
RTC_SCLK
  Top 0.33: U2.7 10.67,22.97 10.09,23.55 7.98,23.55 7.01,24.52 7.01,26.62 8.46,28.07 8.46,31.17 7.66,31.97 U3.55
RTC_SIMO  (via drill 0.45)
  Top 0.33: v7.83,28.86 8,28.86 8,28.26 6.56,26.81 6.56,24.33 7.79,23.09 8.6,23.09 9.33,22.37 U2.9 | U3.53 8.04,32.98 9.55,31.46 v9.55,28.86
  Bottom 0.33: v7.83,28.86 v9.55,28.86
RTC_SOMI
  Top 0.33: U3.54 7.9,32.47 8.92,31.45 8.92,27.87 7.5,26.45 7.5,24.74 7.55,24.69 7.55,24.67 8.13,24.08 10.49,24.08 11.18,23.4 U2.6
RX_DEBUG
  Top 0.33: U3.29 19.36,33.47 20.35,32.49 20.35,32.04 21.85,30.54 21.85,29.44 23.32,27.97 JP2.2
SW
  pour Top (isolate 0.203, no thermals): 36.83,40.11 36.83,37.19 41.66,37.19 41.66,38.84 37.09,38.84 37.09,40.11
TX_DEBUG  (via drill 0.45)
  Top 0.33: v20.83,30.21 20.53,30.51 20.53,31.17 19.76,31.94 19.76,32.21 19,32.97 U3.28
  Bottom 0.33: v20.83,30.21 21.34,30.71 21.34,31.78 JP2.8 JP2.7
VCAP  (via drill 0.45)
  Top 0.33: 41.27,43.13 40.46,42.32 40.78,42.32 | 35.82,45.32 36.45,44.68 38.1,44.68 | v42.78,42.32 41.28,42.32 40.78,42.32 | D2.A v25.66,20.43 | L1.1 40.78,42.32
  Top 0.508: JP6.2 39.37,47.35 38.1,46.08 JP5.3 38.1,44.68 | JP10.1 35.44,45.7 35.82,45.32 | JP10.1 34.04,46.33 33.53,46.84 30.36,46.84 28.98,45.47 TR1.1 | JP10.1 34.56,45.18 C30.1
  Bottom 0.33: v25.66,20.43 27.82,22.59 27.82,24.36 28.32,24.87 32.13,24.87 33.02,25.76 33.02,30.33 34.42,31.73 37.09,31.73 37.6,32.24 37.6,35.03 38.99,36.43 42.55,36.43 43.06,36.94 43.06,42.02 42.78,42.3 v42.78,42.32
  pour Top (isolate 0.203, rank 2, no thermals): 36.83,41.13 36.83,42.65 34.55,42.65 34.55,44.05 35.56,44.05 35.56,45.32 38.74,45.32 38.88,44.05 41.66,44.05 41.66,42.14 37.09,42.14 37.09,41.13
VCAP_HALF  (via drill 0.45)
  Top 0.33: v19.84,30.54 19.78,30.47 U3.23 | U1.1 21.58,41.24 | TR1.W 22.86,41.38 22.72,41.24 21.58,41.24 | v21.21,40.87 21.58,41.24 | JP8.10 22.3,48.57 22.3,48.56 20.58,46.83 20.58,46.46
  Top 0.4: TR1.W 20.58,44.5 20.58,46.46
  Bottom 0.33: v19.84,30.54 19.84,39.5 v21.21,40.87
VCC  (via drill 0.4, 0.41, 0.45)
  Top 0.33: v18.24,40.19 18.2,40.22 U1.5 | U6.1 15.51,40.64 v15.7,40.44 | v19.03,37.19 19.8,37.19 C11.1 20.18,38.7 20.72,39.24 R7.2 | U3.49 4.96,36.92 | v4.58,25.38 4.58,26.08 U3.64 | v9.15,17 9.74,17 U2.13 | 4.96,36.92 5.34,37.29 v5.34,37.83 | C5.1 3.95,36.92 4.96,36.92 | TR2.1 20.21,24.22 v19.56,24.87 19.12,24.43 C7.1 18.32,24.52 17.91,24.92 15.44,24.92 U3.16 | U5.5 24.79,36.68 v24.01,36.68 | R9.2 v4.96,21.32
  other vias: 35.06,38.97 35.56,37.7
  pour Bottom: -0.76,54.34 52.07,54.34 52.07,9.12 28.96,9.12 28.96,-0.78 -0.25,-0.78 -0.76,-0.78
  pour Top (isolate 0.203, no thermals): 35.44,39.98 36.33,39.98 36.33,37.19 34.42,37.19 34.42,39.48 35.44,39.48
VREF
  Top 0.33: U6.2 16.13,43.92 19.41,43.92 19.9,43.43 U1.3 19.45,42.54 19.26,42.35 19.26,40.68 19.69,40.24 21.47,40.24 21.85,40.62 24.26,40.62 24.64,40.24 24.64,39.48 25.66,38.46 25.66,36.3 26.18,35.78 U5.3
VSYS
  Top 0.508: JP1.4 44.96,46.59 41.91,46.59 JP6.1

### Text on the board
tPlace: CS | WR | _ | CP / 2 | RST | PF | CLK | SOMI | SIMO | Vmax | Trigger | Direct | + | _ | Clear / Checkpoints | - | Harvester | + | OFF | PWR IND | POWER | L1 | L2 | ON | Buffer Capacitor | - | Extended
bPlace: BFree Shield Rev E. / for CircuitPython / Design: Josiah Hester & Vito Kortbeek | Rating (Min | Typ | Max) / Charge I: (x | 5mA | 800mA) / Charge V: (1V | 3V | 10V) / Discharge I: (x | 10mA | 200mA) / Discharge V: (0.7V | 1V | x) | Overvoltage Load Resistor | github.com/TUDSSL/BFree
214bmp: D:/SmartProjects/Snc/a4_bn_logo2.bmp